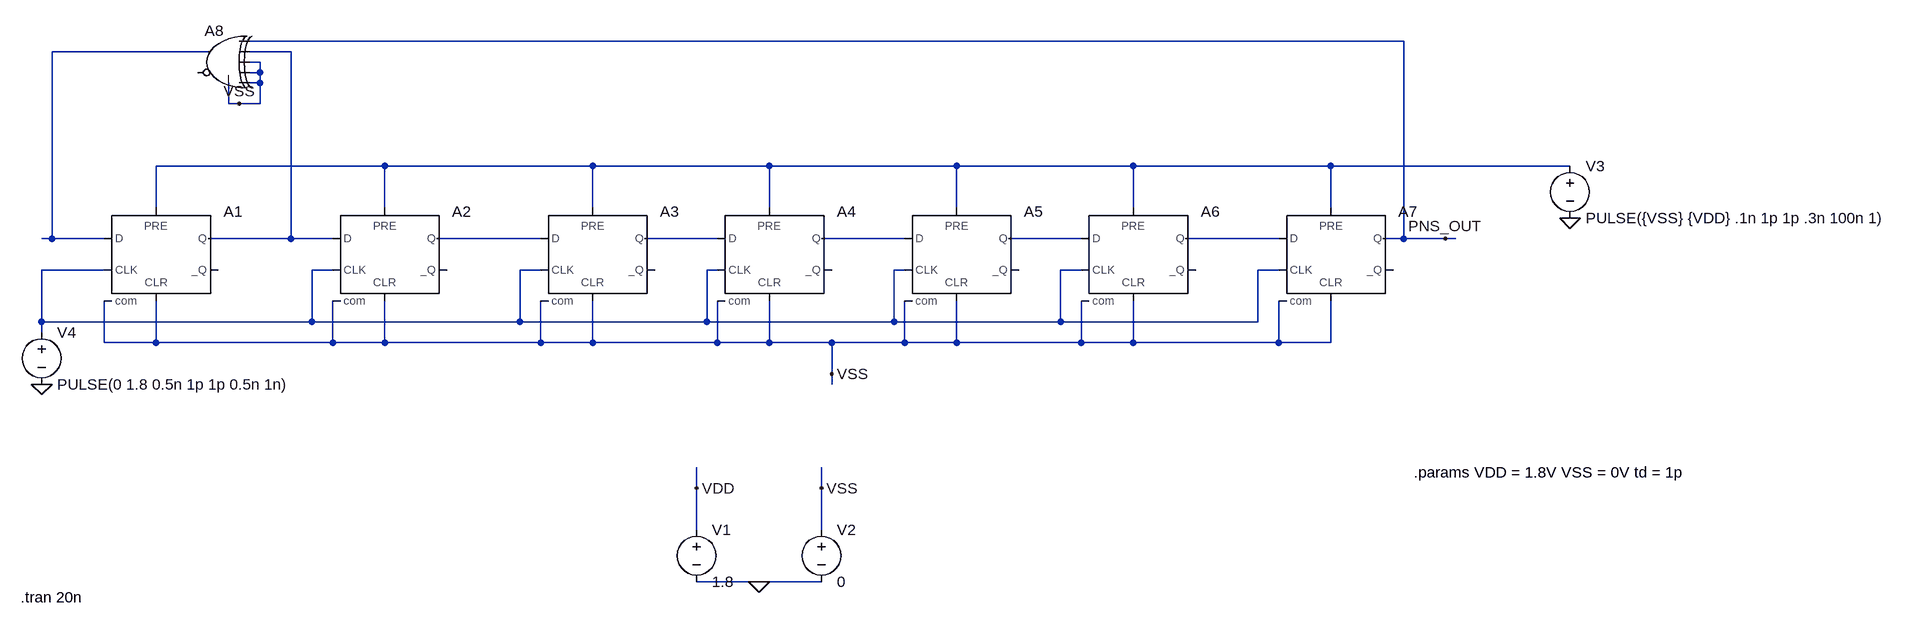
[diagram p0: schematic PNS.asc]
PNS.asc, the LTspice schematic file:
Version 4
SHEET 1 2636 680
WIRE 1856 -224 80 -224
WIRE 16 -208 -224 -208
WIRE 144 -208 80 -208
WIRE 96 -192 80 -192
WIRE 96 -176 96 -192
WIRE 96 -176 80 -176
WIRE 96 -160 96 -176
WIRE 96 -160 80 -160
WIRE 48 -128 48 -160
WIRE 64 -128 48 -128
WIRE 96 -128 96 -160
WIRE 96 -128 64 -128
WIRE 288 -32 -64 -32
WIRE 608 -32 288 -32
WIRE 880 -32 608 -32
WIRE 1168 -32 880 -32
WIRE 1440 -32 1168 -32
WIRE 1744 -32 1440 -32
WIRE 2112 -32 1744 -32
WIRE -64 32 -64 -32
WIRE 288 32 288 -32
WIRE 608 32 608 -32
WIRE 880 32 880 -32
WIRE 1168 32 1168 -32
WIRE 1440 32 1440 -32
WIRE 1744 32 1744 -32
WIRE -224 80 -224 -208
WIRE -224 80 -240 80
WIRE -144 80 -224 80
WIRE 144 80 144 -208
WIRE 144 80 16 80
WIRE 208 80 144 80
WIRE 528 80 368 80
WIRE 800 80 688 80
WIRE 1088 80 960 80
WIRE 1360 80 1248 80
WIRE 1664 80 1520 80
WIRE 1856 80 1856 -224
WIRE 1856 80 1824 80
WIRE 1920 80 1856 80
WIRE 1936 80 1920 80
WIRE -144 128 -240 128
WIRE 208 128 176 128
WIRE 528 128 496 128
WIRE 800 128 784 128
WIRE 1088 128 1072 128
WIRE 1360 128 1328 128
WIRE 1664 128 1632 128
WIRE -240 208 -240 128
WIRE 176 208 176 128
WIRE 176 208 -240 208
WIRE 496 208 496 128
WIRE 496 208 176 208
WIRE 784 208 784 128
WIRE 784 208 496 208
WIRE 1072 208 1072 128
WIRE 1072 208 784 208
WIRE 1328 208 1328 128
WIRE 1328 208 1072 208
WIRE 1632 208 1632 128
WIRE 1632 208 1328 208
WIRE -240 224 -240 208
WIRE -144 240 -144 176
WIRE -64 240 -64 176
WIRE -64 240 -144 240
WIRE 208 240 208 176
WIRE 208 240 -64 240
WIRE 288 240 288 176
WIRE 288 240 208 240
WIRE 528 240 528 176
WIRE 528 240 288 240
WIRE 608 240 608 176
WIRE 608 240 528 240
WIRE 800 240 800 176
WIRE 800 240 608 240
WIRE 880 240 880 176
WIRE 880 240 800 240
WIRE 976 240 880 240
WIRE 1088 240 1088 176
WIRE 1088 240 976 240
WIRE 1168 240 1168 176
WIRE 1168 240 1088 240
WIRE 1360 240 1360 176
WIRE 1360 240 1168 240
WIRE 1440 240 1440 176
WIRE 1440 240 1360 240
WIRE 1664 240 1664 176
WIRE 1664 240 1440 240
WIRE 1744 240 1744 176
WIRE 1744 240 1664 240
WIRE 976 288 976 240
WIRE 976 304 976 288
WIRE 768 464 768 432
WIRE 960 464 960 432
WIRE 768 528 768 464
WIRE 960 528 960 464
WIRE 864 608 768 608
WIRE 960 608 864 608
FLAG 1920 80 PNS_OUT
FLAG 864 608 0
FLAG 768 464 VDD
FLAG 960 464 VSS
FLAG 2112 48 0
FLAG -240 304 0
FLAG 64 -128 VSS
FLAG 976 288 VSS
SYMBOL Digital\\dflop -64 32 R0
SYMATTR InstName A1
SYMATTR SpiceLine Trise = 1p Tfall = 1p Td = td
SYMATTR Value2 Vhigh = 1.8 Vlow = 0
SYMBOL Digital\\dflop 288 32 R0
SYMATTR InstName A2
SYMATTR SpiceLine Trise = 1p Tfall = 1p Td = 1p
SYMATTR Value2 Vhigh = 1.8 Vlow = 0
SYMBOL Digital\\dflop 608 32 R0
SYMATTR InstName A3
SYMATTR SpiceLine Trise = 1p Tfall = 1p Td = 1p
SYMATTR Value2 Vhigh = 1.8 Vlow = 0
SYMBOL Digital\\dflop 880 32 R0
SYMATTR InstName A4
SYMATTR SpiceLine Trise = 1p Tfall = 1p Td = 1p
SYMATTR Value2 Vhigh = 1.8 Vlow = 0
SYMBOL Digital\\dflop 1168 32 R0
SYMATTR InstName A5
SYMATTR SpiceLine Trise = 1p Tfall = 1p Td = 1p
SYMATTR Value2 Vhigh = 1.8 Vlow = 0
SYMBOL Digital\\dflop 1440 32 R0
SYMATTR InstName A6
SYMATTR SpiceLine Trise = 1p Tfall = 1p Td = 1p
SYMATTR Value2 Vhigh = 1.8 Vlow = 0
SYMBOL Digital\\dflop 1744 32 R0
SYMATTR InstName A7
SYMATTR SpiceLine Trise = 1p Tfall = 1p Td = 1p
SYMATTR Value2 Vhigh = 1.8 Vlow = 0
SYMBOL Digital\\xor 32 -256 M0
SYMATTR InstName A8
SYMATTR Value2 Vhigh = 1.8 Vlow = 0
SYMBOL voltage 768 512 R0
WINDOW 123 0 0 Left 0
WINDOW 39 0 0 Left 0
SYMATTR InstName V1
SYMATTR Value 1.8
SYMBOL voltage 960 512 R0
WINDOW 123 0 0 Left 0
WINDOW 39 0 0 Left 0
SYMATTR InstName V2
SYMATTR Value 0
SYMBOL voltage 2112 -48 R0
WINDOW 123 0 0 Left 0
WINDOW 39 0 0 Left 0
SYMATTR InstName V3
SYMATTR Value PULSE({VSS} {VDD} .1n 1p 1p .3n 100n 1)
SYMBOL voltage -240 208 R0
WINDOW 123 0 0 Left 0
WINDOW 39 0 0 Left 0
SYMATTR InstName V4
SYMATTR Value PULSE(0 1.8 0.5n 1p 1p 0.5n 1n)
TEXT -272 632 Left 2 !.tran 20n
TEXT 1872 440 Left 2 !.params VDD = 1.8V VSS = 0V td = 1p

The netlist it stands for:
* PNS.asc
A1 N001 VSS N009 N003 VSS VSS N002 VSS DFLOP Vhigh = 1.8 Vlow = 0 Trise = 1p Tfall = 1p Td = td
A2 N002 VSS N009 N003 VSS VSS N004 VSS DFLOP Vhigh = 1.8 Vlow = 0 Trise = 1p Tfall = 1p Td = 1p
A3 N004 VSS N009 N003 VSS VSS N005 VSS DFLOP Vhigh = 1.8 Vlow = 0 Trise = 1p Tfall = 1p Td = 1p
A4 N005 VSS N009 N003 VSS VSS N006 VSS DFLOP Vhigh = 1.8 Vlow = 0 Trise = 1p Tfall = 1p Td = 1p
A5 N006 VSS N009 N003 VSS VSS N007 VSS DFLOP Vhigh = 1.8 Vlow = 0 Trise = 1p Tfall = 1p Td = 1p
A6 N007 VSS N009 N003 VSS VSS N008 VSS DFLOP Vhigh = 1.8 Vlow = 0 Trise = 1p Tfall = 1p Td = 1p
A7 N008 VSS N009 N003 VSS VSS PNS_OUT VSS DFLOP Vhigh = 1.8 Vlow = 0 Trise = 1p Tfall = 1p Td = 1p
A8 PNS_OUT N002 VSS VSS VSS VSS N001 VSS XOR Vhigh = 1.8 Vlow = 0
V1 VDD 0 1.8
V2 VSS 0 0
V3 N003 0 PULSE({VSS} {VDD} .1n 1p 1p .3n 100n 1)
V4 N009 0 PULSE(0 1.8 0.5n 1p 1p 0.5n 1n)
.tran 20n
.params VDD = 1.8V VSS = 0V td = 1p
.backanno
.end